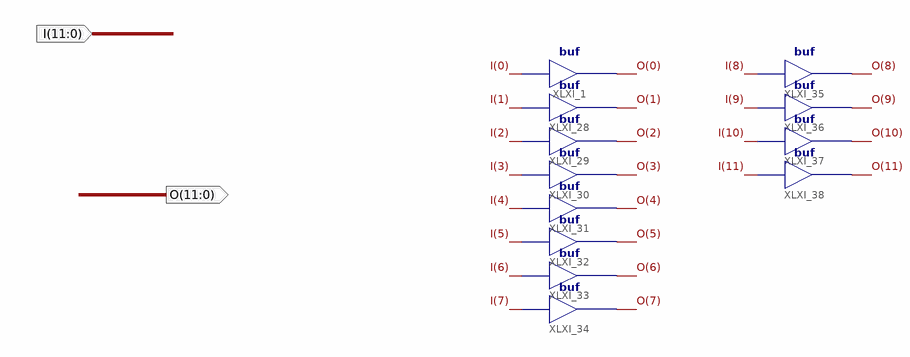
[diagram p0: schematic sheet 1]
// Xilinx ISE schematic buf12.sch (spartan3adsp) as structural Verilog: 12 symbols, 2 ports
module buf12 (
  input  [11:0] I,
  output [11:0] O
);

  buf XLXI_34 (O[7], I[7]);
  buf XLXI_33 (O[6], I[6]);
  buf XLXI_32 (O[5], I[5]);
  buf XLXI_31 (O[4], I[4]);
  buf XLXI_30 (O[3], I[3]);
  buf XLXI_29 (O[2], I[2]);
  buf XLXI_28 (O[1], I[1]);
  buf XLXI_1 (O[0], I[0]);
  buf XLXI_35 (O[8], I[8]);
  buf XLXI_36 (O[9], I[9]);
  buf XLXI_37 (O[10], I[10]);
  buf XLXI_38 (O[11], I[11]);
endmodule
